# EAGLE design USV-BG-001-SP-A (EAGLE 9.5.2)

## Sheet 1 of 2
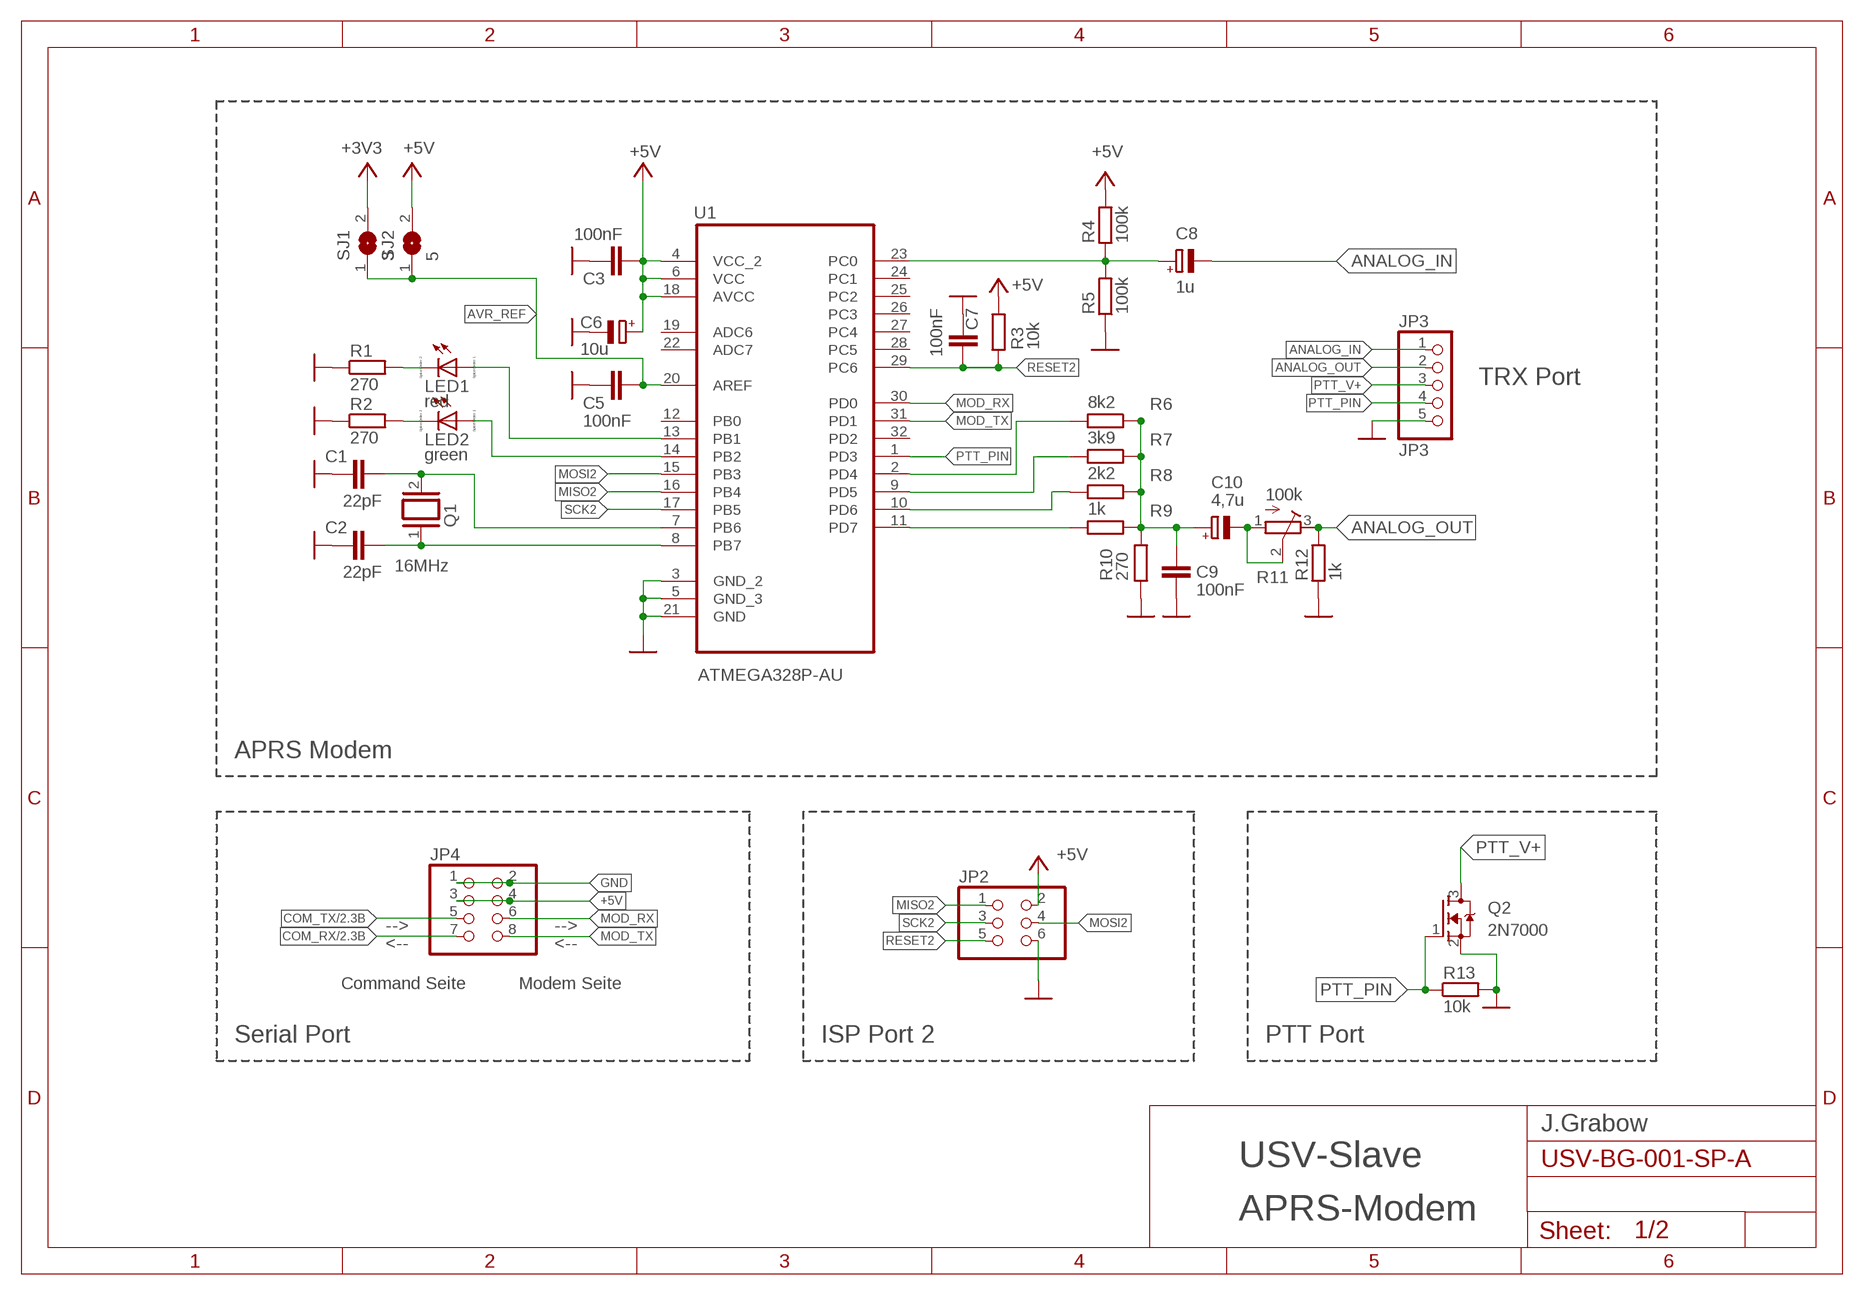
[diagram p0: schematic, sheet 1]

### Parts
C1  22pF  C-EUC0805  [C0805]
C2  22pF  C-EUC0805  [C0805]
C3  100nF  C-EUC0805  [C0805]
C5  100nF  C-EUC0805  [C0805]
C6  10u  CPOL-EUSMCB  [SMC_B]
C7  100nF  C-EUC0805  [C0805]
C8  1u  CPOL-EUSMCB  [SMC_B]
C9  100nF  C-EUC0805  [C0805]
C10  4,7u  CPOL-EUSMCB  [SMC_B]
JP2  PINHD-2X3  [2X03]
JP3  JP3  PINHD-1X5  [1X05]
JP4  PINHD-2X4  [2X04]
LED1  red  LED_E  [LED_1206]
LED2  green  LED_E  [LED_1206]
Q1  16MHz  XTAL/S  [QS]
Q2  2N7000  MOSFET-NREFLOW  [SOT23]
R1  270  R-EU_R0805  [R0805]
R2  270  R-EU_R0805  [R0805]
R3  10k  R-EU_R0805  [R0805]
R4  100k  R-EU_R0805  [R0805]
R5  100k  R-EU_R0805  [R0805]
R6  8k2  R-EU_R0805  [R0805]
R7  3k9  R-EU_R0805  [R0805]
R8  2k2  R-EU_R0805  [R0805]
R9  1k  R-EU_R0805  [R0805]
R10  270  R-EU_R0805  [R0805]
R11  100k  R-TRIMM3339P  [RTRIM3339P]
R12  1k  R-EU_R0805  [R0805]
R13  10k  R-EU_R0805  [R0805]
SJ1  3  SJ  [SJ]
SJ2  5  SJ  [SJ]
U1  ATMEGA328P-AU  [QFP80P900X900X120-32N]

### Nets
+3V3: SJ1.2 ; also sheet 2
+5V: C3.2 C6.+ JP2.2 JP4.3 JP4.4 R3.1 R4.2 SJ2.2 U1.4(VCC_2) U1.6(VCC) U1.18(AVCC) ; also sheet 2
ADC0: C8.+ R4.1 R5.2 U1.23(PC0)
ANALOG_IN: C8.- JP3.1
ANALOG_OUT: JP3.2 R11.3(E) R12.2
AVR_REF: C5.2 SJ1.1 SJ2.1 U1.20(AREF)
COM_RX: JP4.7 ; also sheet 2
COM_TX: JP4.5 ; also sheet 2
DAC_1: R6.2 U1.2(PD4)
DAC_2: R7.2 U1.9(PD5)
DAC_3: R8.2 U1.10(PD6)
DAC_4: R9.2 U1.11(PD7)
GND: C1.2 C2.2 C3.1 C5.1 C6.- C7.1 C9.2 JP2.6 JP3.5 JP4.1 JP4.2 Q2.2(S) R1.1 R2.1 R5.1 R10.1 R12.1 R13.2 U1.3(GND_2) U1.5(GND_3) U1.21(GND) ; also sheet 2
MISO2: JP2.1 U1.16(PB4)
MOD_RX: JP4.6 U1.30(PD0)
MOD_TX: JP4.8 U1.31(PD1)
MOSI2: JP2.4 U1.15(PB3)
N$5: C1.1 Q1.2 U1.7(PB6)
N$6: C9.1 C10.+ R6.1 R7.1 R8.1 R9.1 R10.2
N$7: LED2.C R2.2
N$8: LED2.A U1.14(PB2)
N$9: C10.- R11.1(A) R11.2(S)
N$10: LED1.A U1.13(PB1)
N$12: C2.1 Q1.1 U1.8(PB7)
N$13: LED1.C R1.2
PTT_PIN: JP3.4 Q2.1(G) R13.1 U1.1(PD3)
PTT_V+: JP3.3 Q2.3(D)
RESET2: C7.2 JP2.5 R3.2 U1.29(PC6)
SCK2: JP2.3 U1.17(PB5)
Unconnected: U1.12(PB0) U1.19(ADC6) U1.22(ADC7) U1.24(PC1) U1.25(PC2) U1.26(PC3) U1.27(PC4) U1.28(PC5) U1.32(PD2)

### Notes on the sheet
- TRX Port
- APRS Modem
- --> | -->
- <-- | <--
- Command Seite | Modem Seite
- Serial Port | ISP Port 2 | PTT Port
- J.Grabow
- USV-Slave
- APRS-Modem

## Sheet 2 of 2
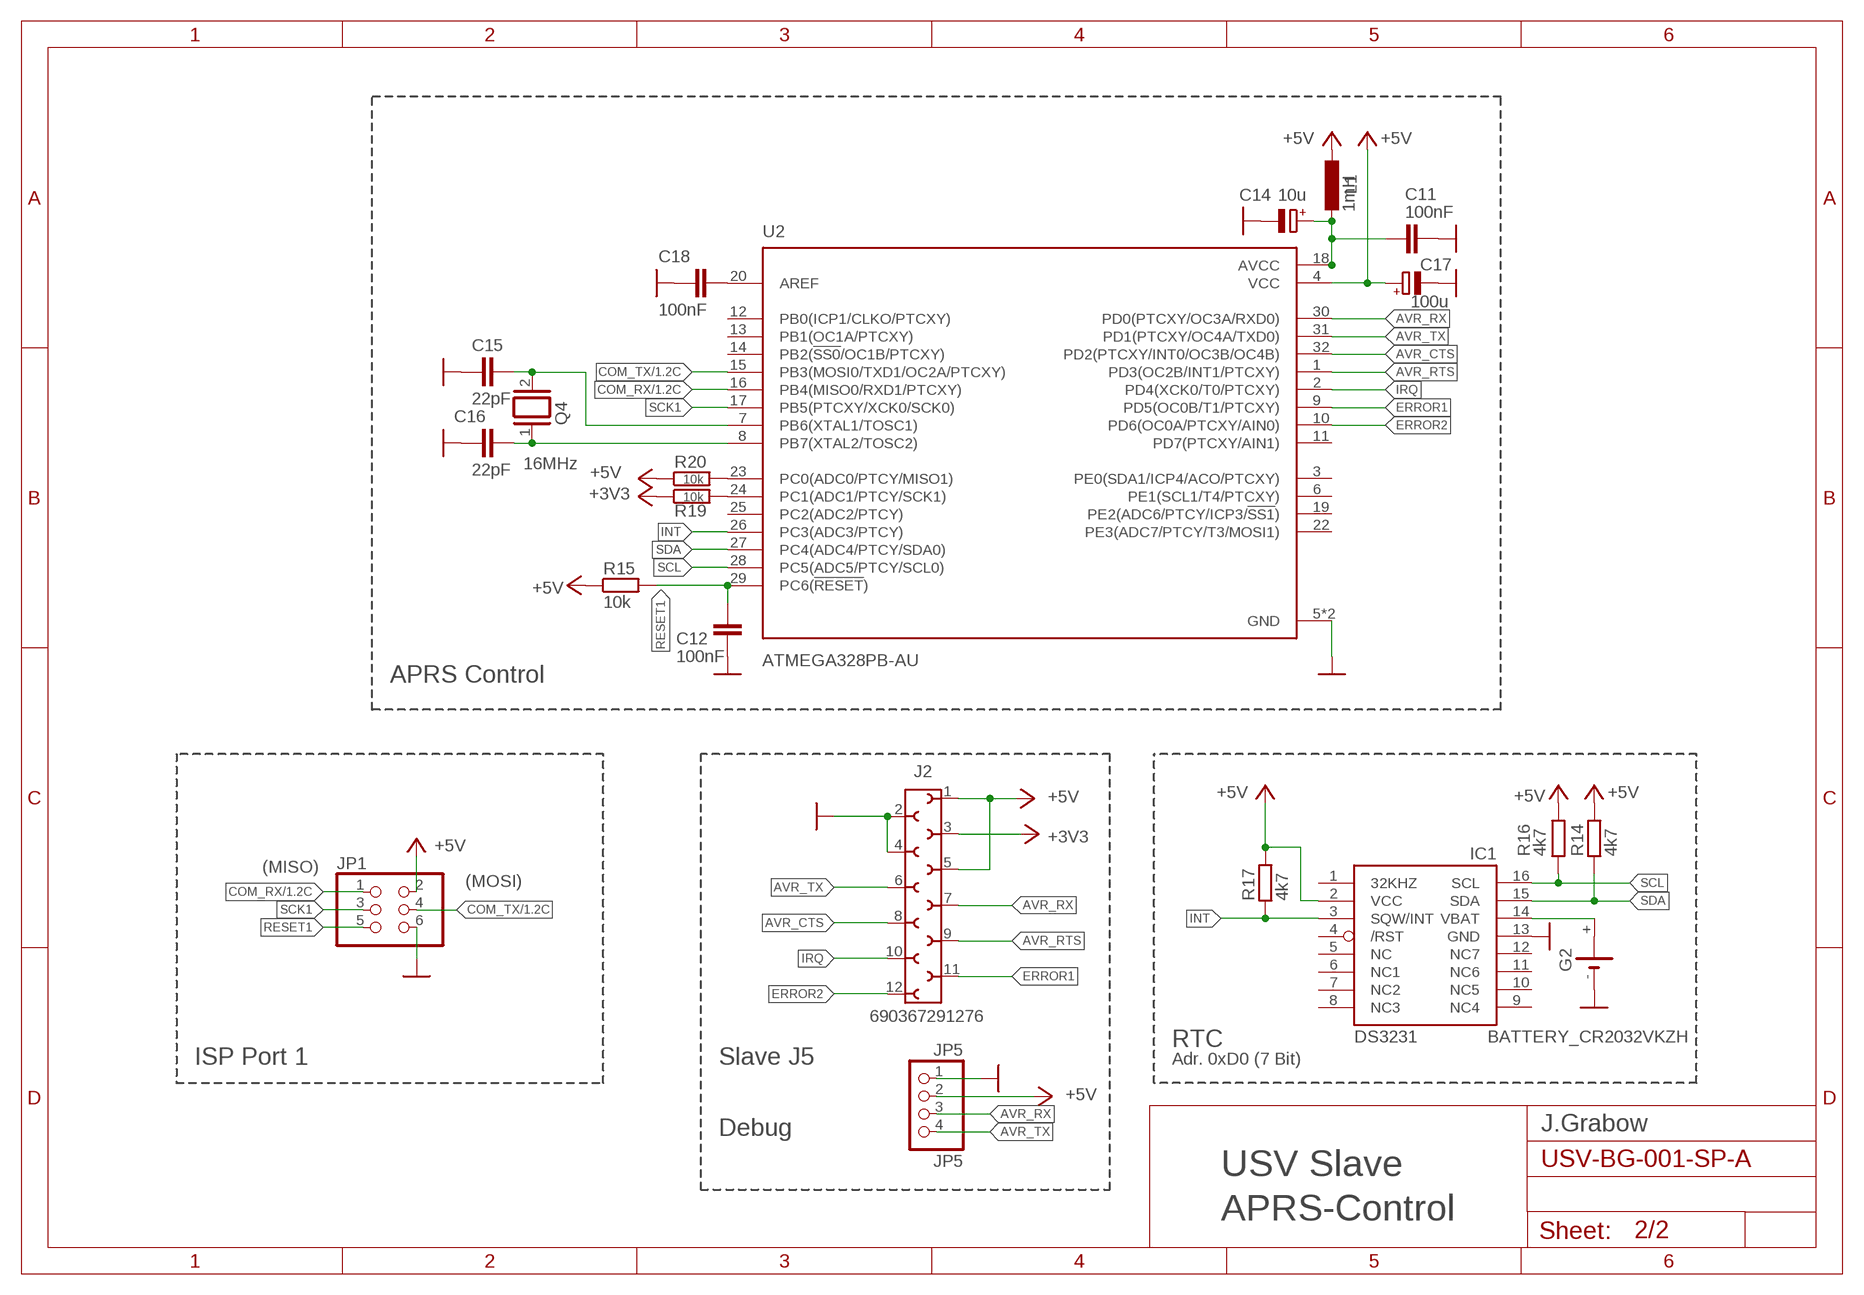
[diagram p1: schematic, sheet 2]

### Parts
C11  100nF  C-EUC0805  [C0805]
C12  100nF  C-EUC0805  [C0805]
C14  10u  CPOL-EUSMCB  [SMC_B]
C15  22pF  C-EUC0805  [C0805]
C16  22pF  C-EUC0805  [C0805]
C17  100u  CPOL-EUSMCB  [SMC_B]
C18  100nF  C-EUC0805  [C0805]
G2  BATTERY_CR2032VKZH  [BATTERY_KZH20PCB-V]
IC1  DS3231/SO  [SO16W]
J2  690367291276  [690367291276]
JP1  PINHD-2X3  [2X03]
JP5  JP5  PINHD-1X4  [1X04]
L1  1mH  L-EUL1812  [L1812]
Q4  16MHz  XTAL/S  [QS]
R14  4k7  R-EU_R0805  [R0805]
R15  10k  R-EU_R0805  [R0805]
R16  4k7  R-EU_R0805  [R0805]
R17  4k7  R-EU_R0805  [R0805]
R19  10k  R-EU_R0805  [R0805]
R20  10k  R-EU_R0805  [R0805]
U2  ATMEGA328PB-AU  [QFP80P900X900X120-32N]

### Nets
+3V3: J2.3 R19.1 ; also sheet 1
+5V: C17.+ IC1.2(VCC) J2.1 J2.5 JP1.2 JP5.2 L1.1 R14.2 R15.1 R16.2 R17.2 R20.1 U2.4(VCC) ; also sheet 1
AVR_CTS: J2.8 U2.32(PD2(PTCXY/INT0/OC3B/OC4B))
AVR_RTS: J2.9 U2.1(PD3(OC2B/INT1/PTCXY))
AVR_RX: J2.7 JP5.3 U2.30(PD0(PTCXY/OC3A/RXD0))
AVR_TX: J2.6 JP5.4 U2.31(PD1(PTCXY/OC4A/TXD0))
COM_RX: JP1.1 U2.16(PB4(MISO0/RXD1/PTCXY)) ; also sheet 1
COM_TX: JP1.4 U2.15(PB3(MOSI0/TXD1/OC2A/PTCXY)) ; also sheet 1
ERROR1: J2.11 U2.9(PD5(OC0B/T1/PTCXY))
ERROR2: J2.12 U2.10(PD6(OC0A/PTCXY/AIN0))
GND: C11.2 C12.2 C14.- C15.2 C16.2 C17.- C18.1 G2.- IC1.13(GND) J2.2 J2.4 JP1.6 JP5.1 U2.5(GND) U2.21(GND) ; also sheet 1
INT: IC1.3(SQW/INT) R17.1 U2.26(PC3(ADC3/PTCY))
IRQ: J2.10 U2.2(PD4(XCK0/T0/PTCXY))
N$1: C16.1 Q4.1 U2.8(PB7(XTAL2/TOSC2))
N$2: C15.1 Q4.2 U2.7(PB6(XTAL1/TOSC1))
N$3: G2.+ IC1.14(VBAT)
N$11: C11.1 C14.+ L1.2 U2.18(AVCC)
N$14: C18.2 U2.20(AREF)
N$15: R20.2 U2.23(PC0(ADC0/PTCY/MISO1))
N$16: R19.2 U2.24(PC1(ADC1/PTCY/SCK1))
RESET1: C12.1 JP1.5 R15.2 U2.29(PC6(!RESET!))
SCK1: JP1.3 U2.17(PB5(PTCXY/XCK0/SCK0))
SCL: IC1.16(SCL) R16.1 U2.28(PC5(ADC5/PTCY/SCL0))
SDA: IC1.15(SDA) R14.1 U2.27(PC4(ADC4/PTCY/SDA0))
Unconnected: G2.+@1(+) IC1.1(32KHZ) IC1.4(/RST) IC1.5(NC) IC1.6(NC1) IC1.7(NC2) IC1.8(NC3) IC1.9(NC4) IC1.10(NC5) IC1.11(NC6) IC1.12(NC7) U2.3(PE0(SDA1/ICP4/ACO/PTCXY)) U2.6(PE1(SCL1/T4/PTCXY)) U2.11(PD7(PTCXY/AIN1)) U2.12(PB0(ICP1/CLKO/PTCXY)) U2.13(PB1(OC1A/PTCXY)) U2.14(PB2(!SS0!/OC1B/PTCXY)) U2.19(PE2(ADC6/PTCY/ICP3/!SS1!)) U2.22(PE3(ADC7/PTCY/T3/MOSI1)) U2.25(PC2(ADC2/PTCY))

### Notes on the sheet
- APRS Control
- (MISO)
- (MOSI)
- RTC
- ISP Port 1 | Slave J5 | Adr. 0xD0 (7 Bit)
- Debug | J.Grabow
- USV Slave
- APRS-Control

## Library data of the parts
C1-C3 C5 C7 C9 C11 C12 C15 C16 C18 = rcl:C-EU: CAPACITOR, European symbol
C6 C8 C10 C14 C17 = rcl:CPOL-EU: POLARIZED CAPACITOR, European symbol
G2 = Aeternum:BATTERY_CR2032V: LI BATTERY Varta
IC1 = DS3231:DS3231; AVAILABILITY: Unavailable; DESCRIPTION: Real Time Clock (RTC) IC Clock/Calendar I²C, 2-Wire Serial 16-SOIC (0.295, 7.50mm Width); MF: Maxim Integrated; MP: DS3231; PACKAGE: SOIC-16 Maxim Integrated; PRICE: None
J2 = Eagle_WR-MM (rev20b):690367291276: WR-MM Female SMT Connector with Latch & Polarization KIND PROPERTIES: Pitch 2.54 mm Gender:Female MATERIAL PROPERTIES: Insulator Material:PA6T Insulator Flammability Rating UL94 V-0 Insulator Color:Red Contact Material :Phosphor Bronze Contact Plating :Mat Tin over Nickel Contact Type: Stamped GENERAL PROPERTIES: Operating Temperature:-40 °C up to +105 °C Compliance Lead free / RoHS ELECTRICAL PROPERTIES: Working Voltage 100 V (AC) Withstanding Voltage:500 V (AC) Contact Resistance: 10 mΩ Insulation Resistance:1000 MΩ PACKAGING PROPERTIES: cULus Approval:E323964 Packaging :Tape and Reel <https://katalog.we-online.com/media/images/v2/o33161v209%20WR-MiMo_69036729xx76.jpg> Details see: Web 1: https://katalog.we-online.com/en/em/MM_1_27_SMT_FEMALE_CONNECTOR_WITH_LATCH_AND_POLARIZATION_69036729XX76_2 Web2: https://katalog.we-online.com/en/em/MM_1_27_SMT_FEMALE_CONNECTOR_WITH_LATCH_AND_POLARIZATION_69036729XX76 Updated by Yingchun,Shan 2019-10-28 2019 (C) Würth Elektronik; DATASHEET-URL: https://www.we-online.com/catalog/datasheet/690367291276.pdf; GENDER: Female; IR: 1.5A; PACKAGING: Tape and Reel; PART-NUMBER: 690367291276; PINS: 12; PITCH: 2.54; TYPE: Straight
JP1 JP2 = pinhead:PINHD-2X3: PIN HEADER
JP3 = pinhead:PINHD-1X5: PIN HEADER
JP4 = pinhead:PINHD-2X4: PIN HEADER
JP5 = pinhead:PINHD-1X4: PIN HEADER
L1 = rcl:L-EU: INDUCTOR, European symbol
LED1 LED2 = eagle-ltspice:LED_E: LED Source: http://www.osram.convergy.de Source: www.luxeon.com Source: www.kingbright.com; SPICEMODEL: NONE; SPICEPREFIX: D; SPICETYPE: diode
Q1 Q4 = special:XTAL/S: CRYSTAL
Q2 = adafruit-edited:MOSFET-N: N-Channel Mosfet 2N7002E - 60V 260mA SOT23 [Digikey: 2N7002ET1GOSTR-ND] - REEL BSH103 - 30V 850mA SOT23 [Digikey: 568-5013-1-ND]
R1-R10 R12-R17 R19 R20 = rcl:R-EU_: RESISTOR, European symbol
R11 = rcl:R-TRIMM: Trimm resistor
SJ1 SJ2 = jumper:SJ: SMD solder JUMPER
U1 = Atmel_By_element14_Batch_1-00:ATMEGA328P-AU: 8-bit Microcontroller with In-System Programmable Flash; MPN: ATMEGA328P-AU; OC_FARNELL: 1715486; OC_NEWARK: 14R4631; PACKAGE: TQFP-32; SUPPLIER: Atmel
U2 = ATMEGA328PB-AU:ATMEGA328PB-AU: ATmega Series 20 MHz 32 KB Flash 2 KB SRAM 8-Bit Microcontroller - TQFP-32 Check prices <https://pricing.snapeda.com/parts/ATMEGA328PB-AU/Microchip%20Technology/view-part?ref=eda>; AVAILABILITY: Good; DESCRIPTION: AVR AVR® ATmega, Functional Safety (FuSa) Microcontroller IC 8-Bit 20MHz 32KB (16K x 16) FLASH; MF: Microchip Technology; MP: ATMEGA328PB-AU; PACKAGE: TQFP-32 Microchip Technology; PRICE: None; PURCHASE-URL: https://pricing.snapeda.com/search/part/ATMEGA328PB-AU/?ref=eda

## Board
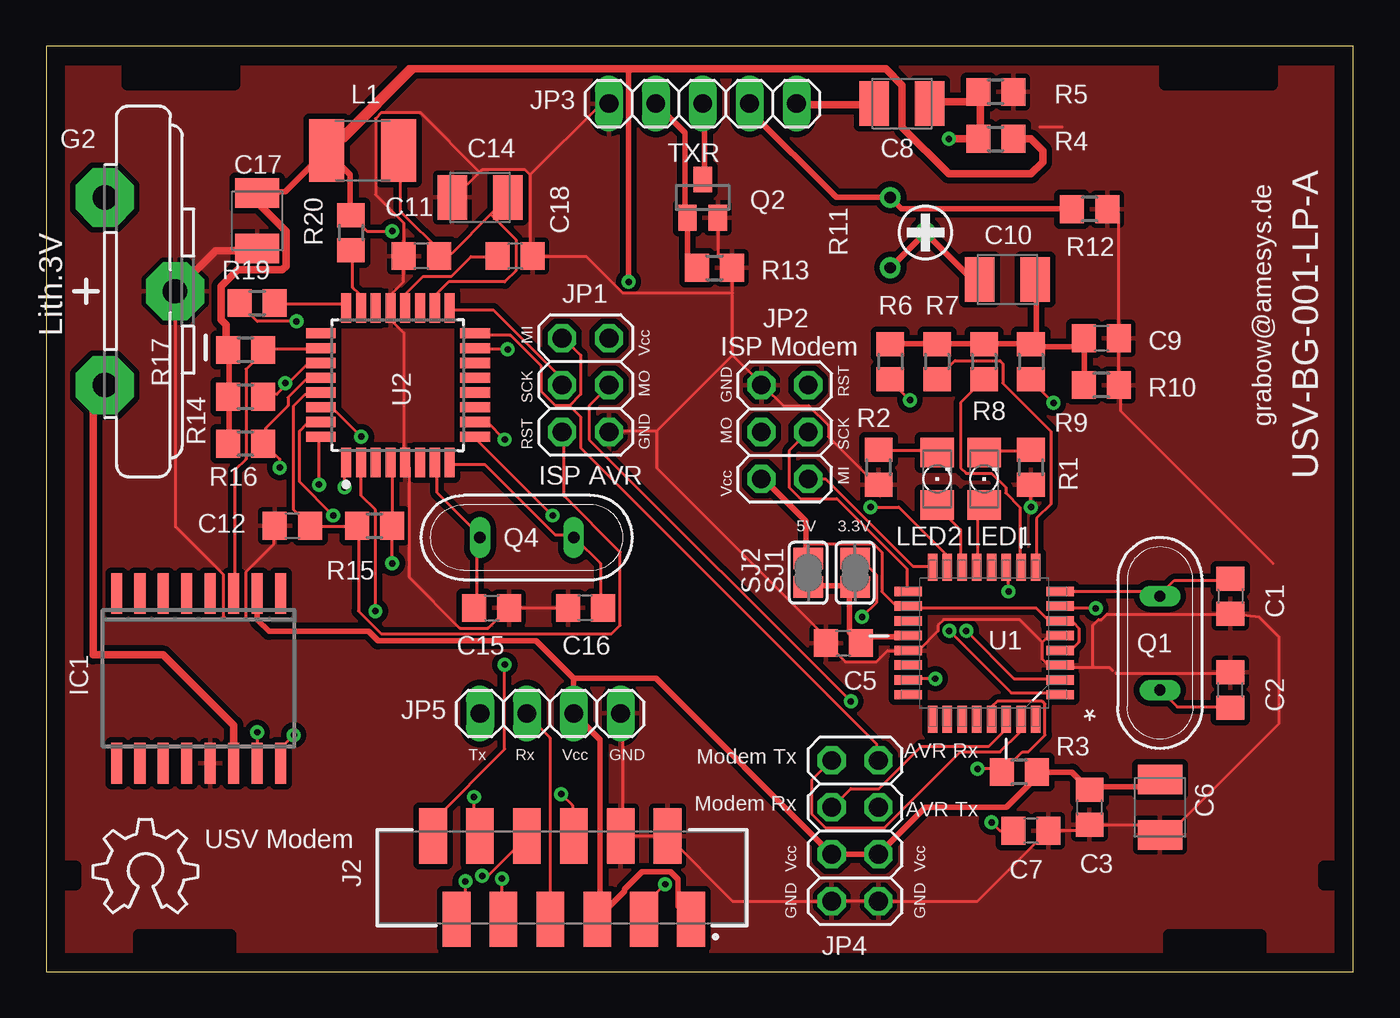
[diagram p2: board, top side]
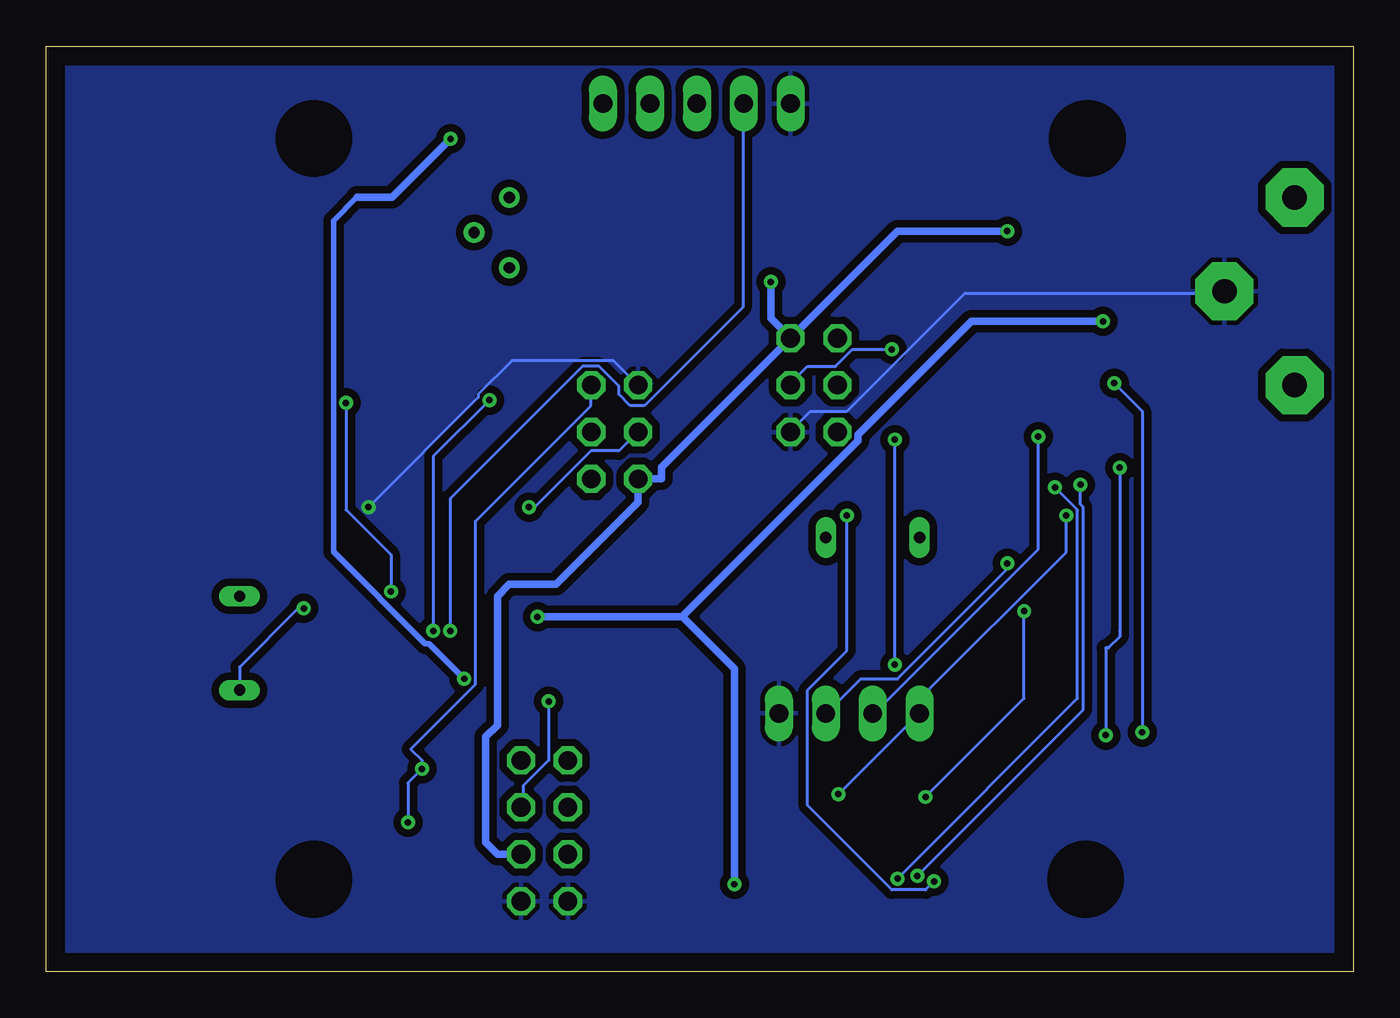
[diagram p3: board, bottom side, seen from below]

Size 70.8 x 50.1 mm. Coordinates in mm from the lower left corner, seen from the top.
Outline: 0,0 70.8,0 70.8,50.1 0,50.1 0,0
Copper layers (1*16): Top 0.035mm / dielectric 1.5mm / Bottom 0.035mm
Design rules "default": minimum track width 6mil, minimum drill 0.35mm, track to track 6mil, track to pad 6mil, pad to pad 6mil, via to via 6mil, smd to smd 6mil, copper to edge 40mil, drill to drill 6mil, minimum pad ring 10mil, minimum via ring 8mil, stop-mask expansion 4mil, vias tented up to drill 0mil, thermal gap 10mil
tRestrict: area 5,0 to 10,2; area 60.8,0 to 65.8,2; area 60.6,48 to 66.4,50; area 4.4,48 to 10.2,50; area 0,4.7 to 1.6,5.7; area 69.2,4.7 to 70.8,5.7
bRestrict: area 12.9,3.4 to 16.1,6.6; area 54.7,3.4 to 57.9,6.6; area 12.8,43.5 to 16,46.7; area 54.7,43.5 to 57.9,46.7

### Footprints (pad centres in the part's own frame; a part is rotated, then mirrored left to right if it is on the bottom)
C0805 = smd 1.3 x 1.5: 1 -0.95,0; 2 0.95,0
SMC_B = smd 1.6 x 2.4: + -1.5,0; - 1.5,0
BATTERY_KZH20PCB-V = drill 1.321 pad 3.15 octagon: + 0,-5.08; +@1 0,5.08; - 3.81,0
SO16W = smd 0.6 x 2.2: 1 -4.445,-4.6; 2 -3.175,-4.6; 3 -1.905,-4.6; 4 -0.635,-4.6; 5 0.635,-4.6; 6 1.905,-4.6; 7 3.175,-4.6; 8 4.445,-4.6; 9 4.445,4.6; 10 3.175,4.6; 11 1.905,4.6; 12 0.635,4.6; 13 -0.635,4.6; 14 -1.905,4.6; 15 -3.175,4.6; 16 -4.445,4.6
690367291276 = smd 1.5 x 3: 1 6.985,-2.25; 2 5.715,2.25; 3 4.445,-2.25; 4 3.175,2.25; 5 1.905,-2.25; 6 0.635,2.25; 7 -0.635,-2.25; 8 -1.905,2.25; 9 -3.175,-2.25; 10 -4.445,2.25; 11 -5.715,-2.25; 12 -6.985,2.25
2X03 = drill 1.016 octagon: 1 -2.54,-1.27; 2 -2.54,1.27; 3 0,-1.27; 4 0,1.27; 5 2.54,-1.27; 6 2.54,1.27
1X05 = drill 1.016 long: 1 -5.08,0; 2 -2.54,0; 3 0,0; 4 2.54,0; 5 5.08,0
2X04 = drill 1.016 octagon: 1 -3.81,-1.27; 2 -3.81,1.27; 3 -1.27,-1.27; 4 -1.27,1.27; 5 1.27,-1.27; 6 1.27,1.27; 7 3.81,-1.27; 8 3.81,1.27
1X04 = drill 1.016 long: 1 -3.81,0; 2 -1.27,0; 3 1.27,0; 4 3.81,0
L1812 = smd 1.9 x 3.4: 1 -1.95,0; 2 1.95,0
LED_1206 = smd 1.6 x 1.803: A -1.422,0; C 1.422,0
QS = drill 0.61 long: 1 -2.54,0; 2 2.54,0
SOT23 = smd 1 x 1.4: 1 -0.823,-1.1; 2 0.823,-1.1; 3 0,0.973
R0805 = smd 1.3 x 1.5: 1 -0.95,0; 2 0.95,0
RTRIM3339P = drill 0.61: 1 -1.905,1.905; 2 0,0; 3 1.905,1.905
SJ = smd 1.168 x 1.6: 1 -0.762,0; 2 0.762,0
QFP80P900X900X120-32N = smd 1.473 x 0.508: 1 -4.115,2.794; 2 -4.115,2.007; 3 -4.115,1.194; 4 -4.115,0.406; 5 -4.115,-0.406; 6 -4.115,-1.194; 7 -4.115,-2.007; 8 -4.115,-2.794; 17 4.115,-2.794; 18 4.115,-2.007; 19 4.115,-1.194; 20 4.115,-0.406; 21 4.115,0.406; 22 4.115,1.194; 23 4.115,2.007; 24 4.115,2.794 | smd 0.508 x 1.473: 9 -2.794,-4.115; 10 -2.007,-4.115; 11 -1.194,-4.115; 12 -0.406,-4.115; 13 0.406,-4.115; 14 1.194,-4.115; 15 2.007,-4.115; 16 2.794,-4.115; 25 2.794,4.115; 26 2.007,4.115; 27 1.194,4.115; 28 0.406,4.115; 29 -0.406,4.115; 30 -1.194,4.115; 31 -2.007,4.115; 32 -2.794,4.115
QFP80P900X900X120-32N' = smd 1.6 x 0.55: 1 -4.18,2.8; 2 -4.18,2; 3 -4.18,1.2; 4 -4.18,0.4; 5 -4.18,-0.4; 6 -4.18,-1.2; 7 -4.18,-2; 8 -4.18,-2.8; 17 4.18,-2.8; 18 4.18,-2; 19 4.18,-1.2; 20 4.18,-0.4; 21 4.18,0.4; 22 4.18,1.2; 23 4.18,2; 24 4.18,2.8 | smd 0.55 x 1.6: 9 -2.8,-4.18; 10 -2,-4.18; 11 -1.2,-4.18; 12 -0.4,-4.18; 13 0.4,-4.18; 14 1.2,-4.18; 15 2,-4.18; 16 2.8,-4.18; 25 2.8,4.18; 26 2,4.18; 27 1.2,4.18; 28 0.4,4.18; 29 -0.4,4.18; 30 -1.2,4.18; 31 -2,4.18; 32 -2.8,4.18

### Placement (x,y rotation side)
C1  64.14,15.24 90 top
C2  64.14,20.32 270 top
C3  56.52,8.89 90 top
C5  43.18,17.78 0 top
C6  60.33,8.89 270 top
C7  53.34,7.62 180 top
C8  46.35,46.99 180 top
C9  57.15,34.29 0 top
C10  52.07,37.47 180 top
C11  20.32,38.73 180 top
C12  13.34,24.13 180 top
C14  23.5,41.91 180 top
C15  24.13,19.68 0 top
C16  29.21,19.68 180 top
C17  11.43,40.64 270 top
C18  25.4,38.73 180 top
G2  3.17,36.83 0 top
IC1  8.26,15.88 180 top
J2  27.94,5.08 0 top
JP1  29.21,31.75 270 top
JP2  40.01,29.21 90 top
JP3  35.56,46.99 180 top
JP4  43.81,7.62 90 top
JP5  27.3,13.97 180 top
L1  17.14,44.45 0 top
LED1  50.8,26.67 90 top
LED2  48.26,26.67 90 top
Q1  60.33,17.78 270 top
Q2  35.56,41.91 0 top
Q4  26.04,23.5 180 top
R1  53.34,27.3 90 top
R2  45.09,27.3 90 top
R3  52.7,10.79 180 top
R4  51.44,45.09 0 top
R5  51.44,47.62 180 top
R6  45.72,33.02 270 top
R7  48.26,33.02 270 top
R8  50.8,33.02 270 top
R9  53.34,33.02 270 top
R10  57.15,31.75 180 top
R11  47.62,40.01 90 top
R12  56.52,41.27 180 top
R13  36.2,38.1 0 top
R14  10.79,31.11 180 top
R15  17.78,24.13 180 top
R16  10.79,28.57 180 top
R17  10.79,33.66 180 top
R19  11.43,36.2 0 top
R20  16.51,40.01 270 top
SJ1  43.81,21.59 90 top
SJ2  41.27,21.59 90 top
U1  50.8,17.78 180 top
U2  ATMEGA328PB-AU  [QFP80P900X900X120-32N']  19.05,31.75 90 top
U$1  [OSHW_6X200_NOTEXT]  2.54,3.17 0 top

### Tracks (layer width: path | path; a pad name or v marks a point on that pad's centre or on a via)
+3V3  (via drill 0.35)
  Top 0.152: v13.56,35.2 11.43,35.2 10.52,36.12 R19.1 | v44.2,19.2 44.96,19.96 44.96,21.49 44.2,22.25 43.89,22.25 SJ1.2 | v33.53,4.72 32.46,3.66 32.46,2.9 J2.3
  Bottom 0.406: v33.53,4.72 33.53,16.38 36.35,19.2 | 36.35,19.2 v44.2,19.2 | v13.56,35.2 20.68,35.2 26.82,29.06 26.82,28.75 36.35,19.22 36.35,19.2
+5V  (via drill 0.35)
  Top 0.152: 9.91,28.65 R16.2 | 9.91,31.09 R14.2 9.91,31.24 | 9.91,33.53 R17.2 9.75,33.68 | 16.46,41 R20.1 16.61,40.84 17.37,40.08 v18.75,40.08 | 15.24,44.35 L1.1 15.09,44.35 | 11.43,42.22 C17.+ | U1.4 55.02,17.37 55.47,17.37 55.93,17.83 55.93,18.59 55.63,18.9 55.02,18.9 U1.6 54.86,19.05 54.25,19.05 53.65,19.66 46.79,19.66 U1.18 46.63,19.81 46.02,19.81 45.26,20.57 45.26,22.71 44.81,23.16 41.15,23.16 | 41.15,22.4 SJ2.2 | 38.86,26.67 JP2.2 | 53.8,10.67 R3.1 | 59.84,10.01 60.2,10.36 C6.+ | 29.87,2.9 J2.5 | U2.4 18.75,27.43 18.75,24.23 R15.1 18.75,24.08 v18.75,22.1 | 11.43,20.32 11.43,20.42 IC1.2 | J2.1 34.9,2.9 34.29,3.5 34.21,3.54 | C3.2 56.54,9.91 56.54,10.06 56.68,10.01
  Top 0.305: 9.91,31.09 9.91,28.65 | 9.91,31.24 9.91,33.53 | 16.46,41 16.46,43.13 15.24,44.35 | 11.43,42.22 12.95,42.22 15.09,44.35 | 41.15,22.4 41.15,23.16 41.15,24.38 38.86,26.67 | v31.55,37.34 31.55,48.77 | 28.57,15.88 33.02,15.88 JP4.4 JP4.3 47.62,8.89 52.02,8.89 53.8,10.67 | 28.57,15.88 JP5.2 30,12.55 30,3.02 | 30,3.02 31.33,4.36 31.33,4.46 32.28,5.41 33.81,5.41 34.21,5.01 34.21,3.54 | 30,3.02 29.87,2.9 | R3.1 55.56,10.79 C3.2 | 56.68,10.01 59.84,10.01 | 28.57,15.88 26.54,17.91 17.98,17.91 17.47,18.41 12.06,18.41 11.43,19.05 11.43,20.32
  Top 0.406: 31.55,48.77 31.43,48.88 19.67,48.88 15.88,45.09 16.13,45.09 19.91,48.87 45.48,48.87 46.35,47.99 46.35,45.72 48.9,43.18 53.34,43.18 53.98,43.81 53.98,44.45 53.34,45.09 R4.2 | 9.75,35.02 9.75,34.92 | 9.75,34.92 9.75,33.68 | 9.75,34.92 9.75,35.02 | 11.43,42.22 11.43,41.64 12.99,40.09 12.99,38.19 12.78,37.98 10.37,37.98 9.47,37.09 9.47,35.3 9.75,35.02
  Bottom 0.152: v18.75,22.1 18.75,21.79 24.69,15.85 26.67,15.85 28.5,14.02 JP5.2
  Bottom 0.406: v18.75,40.08 24.69,40.08 JP1.2 | JP1.2 37.47,27.3 37.47,26.67 JP2.2 38.73,25.4 43.18,20.95 45.72,20.95 46.35,20.32 46.35,13.34 46.99,12.7 46.99,6.99 46.35,6.35 JP4.3 | v31.55,37.34 31.55,35.36 JP1.2
ADC0  (via drill 0.35)
  Top 0.152: v48.16,15.85 46.79,15.85 U1.23 | C8.+ 48.01,46.94 C8.+ | 50.6,47.09 50.6,47.55 R5.2 | 50.6,47.09 50.6,46.94 | 50.6,46.94 R5.2 | R4.1 50.6,44.93 R4.1 | R4.1 50.6,45.09 R4.1 | 50.6,46.94 R5.2 | 50.6,47.09 R5.2 | 48.01,47.09 C8.+ | 50.16,45.09 R4.1
  Top 0.406: 50.6,46.94 50.6,45.09 | 48.01,47.09 50.6,47.09 | v48.9,45.09 50.16,45.09
  Bottom 0.152: 53.95,41.91 53.98,41.91 53.95,41.91
  Bottom 0.305: v48.16,15.85 50.07,17.76 50.27,17.76 55.24,22.73 55.24,40.64 53.98,41.91
  Bottom 0.406: v48.9,45.09 52.07,41.91 53.95,41.91
ANALOG_IN
  Top 0.152: 44.81,46.94 C8.- | 40.69,46.94 JP3.1
  Top 0.406: 40.69,46.94 44.81,46.94
ANALOG_OUT
  Top 0.152: 55.47,41.3 R12.2
  Top 0.305: JP3.2 38.1,46.61 42.8,41.91 R11.3 46.33,41.3 55.47,41.3
AVR_CTS  (via drill 0.35)
  Top 0.152: v14.78,26.36 14.78,28.8 U2.32 | v23.62,5.18 23.93,5.18 26.06,7.32 J2.8
  Bottom 0.152: v14.78,26.36 14.78,25.3 14.63,25.15 14.63,14.17 v23.62,5.18
AVR_REF
  Top 0.152: 41.3,20.88 SJ2.1 | 43.74,20.88 SJ1.1 43.74,20.73 | 44.5,18.14 44.2,17.83 C5.2 44.04,17.83 43.59,18.29 | 46.63,18.14 U1.20
  Top 0.305: 43.74,20.88 41.3,20.88 | 44.5,18.14 46.63,18.14 | 43.59,18.29 43.51,18.36 43.51,20.5 43.74,20.73
AVR_RTS  (via drill 0.35)
  Top 0.152: v16.15,26.21 16.15,27.43 U2.1 | v24.69,5.03 24.69,2.9 J2.9
  Bottom 0.152: v16.15,26.21 14.94,24.99 14.94,14.78 v24.69,5.03
AVR_RX  (via drill 0.35)
  Top 0.152: v17.07,28.96 15.54,30.48 14.94,30.48 U2.30 | J2.7 27.28,2.9 27.28,12.65 26.06,13.87 JP5.3
  Bottom 0.152: v17.07,28.96 17.07,22.86 25.91,14.02 JP5.3
AVR_TX  (via drill 0.35)
  Top 0.152: v15.54,24.69 13.72,26.52 13.72,29.26 14.17,29.72 14.78,29.72 U2.31 | v27.89,9.6 28.5,8.99 28.5,7.47 J2.6
  Bottom 0.152: v15.54,24.69 15.54,22.71 23.47,14.78 23.47,14.02 JP5.4 23.62,13.87 v27.89,9.6
COM_RX
  Top 0.152: 28.35,30.63 27.58,30.63 26.82,31.39 26.82,32.77 25.15,34.44 23.32,34.44 U2.16 | 28.35,30.63 28.96,31.24 28.96,33.38 28.04,34.29 JP1.1 | 28.35,30.63 28.96,30.02 28.96,28.35 44.96,12.34 44.96,11.43 JP4.7
COM_TX  (via drill 0.35)
  Top 0.152: v24.99,33.68 23.32,33.68 U2.15 | v43.59,14.63 29.41,28.8 29.41,30.63 30.48,31.7 JP1.4
  Bottom 0.152: v24.99,33.68 27.13,33.68 28.04,32.77 29.57,32.77 30.48,31.85 JP1.4 | v43.59,14.63 43.59,11.43 44.96,10.06 44.96,8.99 JP4.5
DAC_1  (via drill 0.35)
  Top 0.152: v49.84,18.44 52.43,15.85 54.86,15.85 U1.2 | v46.79,30.94 45.72,32 R6.2
  Bottom 0.152: v49.84,18.44 49.84,27.89 v46.79,30.94
DAC_2
  Top 0.152: U1.9 53.65,21.95 53.65,24.54 54.41,25.3 54.41,29.26 51.82,31.85 51.82,32.92 51.66,33.07 49.23,33.07 48.31,32.16 R7.2
DAC_3
  Top 0.152: U1.10 52.73,21.95 52.73,25.15 51.97,25.91 51.97,26.21 51.21,26.98 49.84,26.98 49.53,27.28 49.53,30.79 50.75,32 R8.2
DAC_4  (via drill 0.35)
  Top 0.152: v52.12,20.57 52.12,21.79 U1.11 | v54.56,30.79 53.34,32 R9.2
  Bottom 0.152: v52.12,20.57 52.12,22.55 54.56,24.99 v54.56,30.79
ERROR1  (via drill 0.35)
  Top 0.152: v27.43,24.69 23.32,28.8 U2.9 | v22.71,4.88 22.71,3.35 22.25,2.9 J2.11
  Bottom 0.152: v27.43,24.69 27.43,17.37 29.57,15.24 29.57,8.99 24.99,4.42 23.16,4.42 v22.71,4.88
ERROR2  (via drill 0.35)
  Top 0.152: v24.84,28.8 23.93,29.72 23.32,29.72 U2.10 | v24.84,16.61 24.84,12.04 21.03,8.23 21.03,7.47 J2.12
  Bottom 0.152: v24.84,16.61 v24.84,28.8
GND  (via drill 0.35)
  Top 0.152: JP5.1 31.24,13.87 31.24,7.47 J2.4 31.24,7.32 33.53,7.32 J2.2 33.68,7.32 37.19,3.81 42.52,3.81 JP4.2 42.67,3.81 44.96,3.81 JP4.1 45.11,3.81 50.44,3.81 54.25,7.62 C7.1 54.41,7.62 56.08,7.62 56.39,7.92 C3.1 56.54,7.92 59.74,7.92 60.2,7.47 C6.- 60.35,7.47 60.81,7.47 66.75,13.41 66.75,18.14 65.7,19.18 C2.2 64.11,19.36 57.45,19.36 57.15,19.05 57,19.05 56.69,18.75 56.69,16.46 | 58.06,34.29 58.06,31.85 R10.1 58.22,31.7 58.22,30.33 66.45,22.1 | 58.06,34.29 C9.2 58.06,34.29 | 55.02,45.72 53.8,45.72 | 58.06,41.03 58.06,34.29 | 56.69,16.46 57.61,16.46 57.76,16.31 | 56.69,16.46 55.02,16.46 U1.3 54.86,16.61 54.25,16.61 53.95,16.92 53.95,17.83 | 53.95,17.83 54.25,18.14 54.86,18.14 U1.5 | 57.91,16.15 64.11,16.15 C1.2 | 53.95,17.83 52.73,19.05 48.62,19.05 48.31,18.75 48.31,18.44 47.24,17.37 46.79,17.37 U1.21 46.63,17.37 45.57,17.37 44.96,16.76 43.28,16.76 42.37,17.68 C5.1 42.22,17.83 42.22,18.14 33.07,27.28 33.07,29.26 | 9.14,39.01 10.79,39.01 11.43,39.01 C17.- | 8.99,10.67 8.99,11.12 IC1.13 | C12.2 12.34,24.08 12.34,23.16 10.82,21.64 10.82,19.05 9.75,19.05 9.6,19.2 9.6,21.49 7.01,24.08 7.01,36.73 G2.- | C16.2 28.19,19.66 25.15,19.66 C15.2 24.99,19.66 23.93,18.59 22.4,18.59 19.66,21.34 19.66,27.28 19.51,27.43 U2.5 19.36,27.58 19.36,34.59 18.75,35.2 18.75,35.81 U2.21 18.75,35.97 18.75,36.73 19.36,37.34 19.36,38.71 C11.2 19.36,38.86 19.36,40.54 17.83,42.06 17.83,46.18 18.14,46.48 20.27,46.48 23.47,43.28 | 26.21,43.13 26.21,38.86 C18.1 26.36,38.71 29.26,38.71 31.24,36.73 37.19,36.73 | 26.21,43.13 25.91,43.43 23.62,43.43 23.47,43.28 | 23.47,43.28 22.1,41.91 C14.-
  Top 0.152: 26.21,43.13 30.02,46.94 30.48,46.94 JP3.5 | Q2.2 36.42,40.69 36.42,38.71 37.03,38.1 R13.2 37.19,38.1 37.19,36.73 | R2.1 44.96,26.36 42.37,28.96 42.37,29.57 41.3,30.63 39.93,30.63 38.86,31.7 JP2.6 38.71,31.85 37.19,33.38 | v53.34,25.15 53.34,26.21 R1.1 | 37.19,33.38 37.19,36.73 | 33.07,29.26 30.48,29.26 JP1.6 | 37.19,33.38 33.07,29.26
  Top 0.406: G2.- 9.17,39.01 10.79,39.01
  Bottom 0.152: v53.34,25.15 47.4,31.09 47.4,31.24 45.57,33.07 40.08,33.07 38.86,31.85 JP2.6 | G2.- 7.01,36.73 21.03,36.73 27.43,30.33 29.41,30.33 30.48,29.26 JP1.6
  pour Top (isolate 0.305): 0,49.53 71.12,49.53 71.12,48.26 71.12,0 0,0
  pour Bottom (isolate 0.406): 0,49.53 71.12,49.53 71.12,0 0,0
INT
  Top 0.152: U2.26 14.78,33.68 11.89,33.68 R17.1 11.73,33.53 10.82,32.61 10.82,27.74 10.21,27.13 10.21,20.57 IC1.3
IRQ  (via drill 0.35)
  Top 0.152: v17.83,19.51 17.83,24.99 17.07,25.76 17.07,27.43 U2.2 | v23.16,9.45 23.16,7.77 23.47,7.47 J2.10
  Bottom 0.152: v17.83,19.51 17.83,14.78 v23.16,9.45
MISO2
  Top 0.152: U1.16 48.01,21.95 46.94,21.95 42.22,26.67 41.3,26.67 JP2.1
MOD_RX
  Top 0.152: U1.30 51.97,13.56 51.97,13.11 51.05,12.19 47.4,12.19 45.11,9.91 43.59,9.91 42.67,8.99 JP4.6
MOD_TX
  Top 0.152: U1.31 52.73,13.56 52.73,12.95 51.66,11.89 49.53,11.89 45.41,7.77 42.22,7.77 41.45,8.53 41.45,10.36 42.52,11.43 JP4.8
MOSI2  (via drill 0.35)
  Top 0.152: v44.65,25.15 46.18,25.15 48.77,22.55 48.77,21.95 U1.15
  Bottom 0.152: v44.65,25.15 44.35,25.15 41.3,28.19 39.78,28.19 38.86,29.11 JP2.4
N$1
  Top 0.152: C16.1 30.02,19.81 30.02,22.1 28.65,23.47 Q4.1 28.5,23.62 27.58,23.62 23.77,27.43 21.95,27.43 U2.8
N$2
  Top 0.152: C15.1 23.32,19.81 23.32,23.32 23.47,23.47 Q4.2 23.47,23.62 21.18,25.91 21.18,27.43 U2.7
N$3
  Top 0.152: 3.2,31.7 G2.+
  Top 0.406: IC1.14 10.16,13.34 6.35,17.14 2.54,17.14 2.54,31.11 3.12,31.7 3.2,31.7
N$5  (via drill 0.35)
  Top 0.152: v56.84,19.66 55.02,19.66 U1.7 | Q1.2 60.35,15.24 61.27,14.33 64.01,14.33 C1.1
  Bottom 0.152: v56.84,19.66 57.15,19.66 60.33,16.48 Q1.2
N$6
  Top 0.152: 56.24,31.85 R10.2 | 45.72,33.98 R6.1 | 48.16,33.98 R7.1 48.31,33.98 | 50.9,33.98 R8.1 50.75,33.98 | 53.34,33.98 R9.1 | R9.1 53.34,33.83 53.65,33.83 R9.1 | 53.65,37.34 C10.+ | 56.24,34.29 56.24,33.83 C9.1 56.24,34.29
  Top 0.305: 56.24,31.85 56.24,33.83 53.65,33.83 53.65,37.34 | 48.16,33.98 45.72,33.98 | 53.34,33.98 50.9,33.98 | 50.75,33.98 48.31,33.98
N$7
  Top 0.152: R2.2 45.11,28.19 48.16,28.19 LED2.C
N$8
  Top 0.152: U1.14 49.53,21.95 49.53,23.93 48.31,25.15 LED2.A
N$9
  Top 0.152: 47.55,39.93 R11.2 47.7,39.93 | 50.14,37.49 50.44,37.49 C10.-
  Top 0.305: 47.55,39.93 R11.1 | 47.7,39.93 50.14,37.49
N$10
  Top 0.152: U1.13 50.44,21.95 50.44,24.84 50.75,25.15 LED1.A
N$11
  Top 0.152: 21.49,38.86 21.95,38.86 24.08,41 | 21.49,38.86 21.34,38.86 C11.1 21.49,38.86 | 24.08,41 C14.+ | 24.08,41 25.45,39.62 25.45,37.95 24.84,37.34 21.79,37.34 21.18,36.73 21.18,35.97 U2.18 | 21.49,38.86 19.2,41.15 19.2,44.35 L1.2
N$12
  Top 0.152: 55.02,20.57 U1.8 55.02,20.57 | 55.02,20.57 60.05,20.57 60.2,20.42 Q1.1 60.35,20.42 61.11,21.18 64.01,21.18 C2.1
N$13
  Top 0.152: R1.2 53.34,28.19 50.9,28.19 LED1.C
N$14
  Top 0.152: C18.2 24.38,38.71 23.01,38.71 21.95,37.64 20.42,37.64 19.51,36.73 19.51,35.97 U2.20
N$15
  Top 0.152: R20.2 16.61,39.01 16.61,37.03 16.92,36.73 16.92,35.97 U2.23
N$16
  Top 0.152: R19.2 12.5,36.12 16,36.12 16.15,35.97 U2.24
PTT_PIN  (via drill 0.35)
  Top 0.152: 34.75,38.56 35.2,38.1 R13.1 | 34.75,40.69 Q2.1 34.59,40.84 | v48.92,18.44 52.27,15.09 54.86,15.09 U1.1 | 33.07,46.94 JP3.4
  Top 0.305: 34.75,38.56 34.75,40.69 | 34.59,40.84 34.59,45.41 33.07,46.94
  Bottom 0.152: v48.92,18.44 48.92,25.6 41.76,32.77 40.84,32.77 39.78,31.7 39.78,31.24 39.17,30.63 38.41,30.63 33.07,35.97 33.07,46.94 JP3.4
PTT_V+
  Top 0.152: 35.66,42.98 Q2.3 | 35.66,46.94 JP3.3
  Top 0.305: 35.66,46.94 35.66,42.98
RESET1
  Top 0.152: U2.29 14.78,31.24 14.02,31.24 13.41,30.63 13.41,24.99 14.17,24.23 C12.1 14.33,24.08 16.76,24.08 R15.2 16.92,24.08 16.92,19.51 18.14,18.29 30.63,18.29 31.09,18.75 31.09,22.71 28.04,25.76 28.04,29.11 JP1.5
RESET2  (via drill 0.35)
  Top 0.152: U1.29 51.21,13.72 51.21,14.33 51.51,14.63 53.95,14.63 54.1,14.48 54.1,12.8 53.19,11.89 52.88,11.89 51.82,10.82 R3.2 51.66,10.82 51.51,10.97 v50.44,10.97 | v51.21,8.08 51.66,7.62 52.27,7.62 C7.2
  Bottom 0.152: JP2.5 41.3,31.7 41.3,30.63 47.55,24.38 47.55,15.54 51.05,12.04 50.44,11.43 v50.44,10.97 51.21,10.21 v51.21,8.08
SCK1
  Top 0.152: U2.17 21.95,35.81 24.23,35.81 27.89,32.16 27.89,31.85 JP1.3
SCK2
  Top 0.152: U1.17 46.63,20.57 46.63,21.79 42.82,25.6 40.84,25.6 40.23,26.21 40.23,28.19 41.15,29.11 JP2.3
SCL  (via drill 0.35)
  Top 0.152: U2.28 14.78,32 14.02,32 13.11,31.09 13.11,30.63 11.89,29.41 11.89,28.65 R16.1 11.89,28.5 12.65,27.74 v12.65,27.28 | v13.41,12.8 12.8,12.19 12.8,11.28 IC1.16
  Bottom 0.152: v12.65,27.28 12.65,18.44 12.65,18.14 13.26,17.53 13.41,17.53 v13.41,12.8
SDA  (via drill 0.35)
  Top 0.152: 13.11,31.85 14.17,32.92 14.78,32.92 U2.27 | 13.11,31.85 12.5,31.24 11.89,31.24 R14.1 | 13.11,31.85 v12.95,31.85 | IC1.15 | v11.43,12.95 IC1.15
  Bottom 0.152: v12.95,31.85 11.43,30.33 v11.43,12.95

### Text on the board
tNames: TXR | MI | Vcc | ISP Modem | SCK | MO | GND | RST | grabow@amesys.de | MO | RST | GND | SCK | USV-BG-001-LP-A | ISP AVR | Vcc | MI | 5V | 3.3V | Modem Tx | AVR Rx | Tx | Rx | Vcc | GND | Modem Rx | AVR Tx | USV Modem | Vcc | Vcc | GND | GND